# EAGLE design fpanel 10x2 v2 (EAGLE 8.6.0)
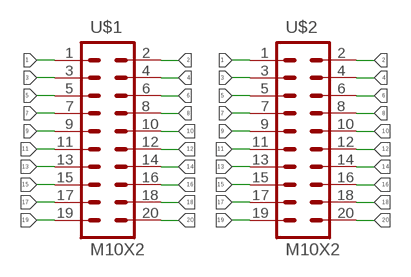
[diagram p0: schematic, sheet 1]

## Parts
U$1  M10X2  [2X10]
U$2  M10X2  [2X10]

## Nets
1: U$1.1 U$2.1
2: U$1.2 U$2.2
3: U$1.3 U$2.3
4: U$1.4 U$2.4
5: U$1.5 U$2.5
6: U$1.6 U$2.6
7: U$1.7 U$2.7
8: U$1.8 U$2.8
9: U$1.9 U$2.9
10: U$1.10 U$2.10
11: U$1.11 U$2.11
12: U$1.12 U$2.12
13: U$1.13 U$2.13
14: U$1.14 U$2.14
15: U$1.15 U$2.15
16: U$1.16 U$2.16
17: U$1.17 U$2.17
18: U$1.18 U$2.18
19: U$1.19 U$2.19
20: U$1.20 U$2.20

## Library data of the parts
U$1 U$2 = SparkFun-Connectors:M10X2: This was SPECIALLY designed to be used with our Graphic LCD Backpack. Be sure you want to use this! It is not only staggered on each line of header holes, but IT IS ALSO offset of the center point of the top and bottom lines by 5 mil. This causes the headers to lock into place on the "standard" footprint on the LCD screen. The extra squares on the tdocu layer are there simply to reference other pins (if you were to actually populate a longer header than ten long - this is what we do with the backpacks).

## Board
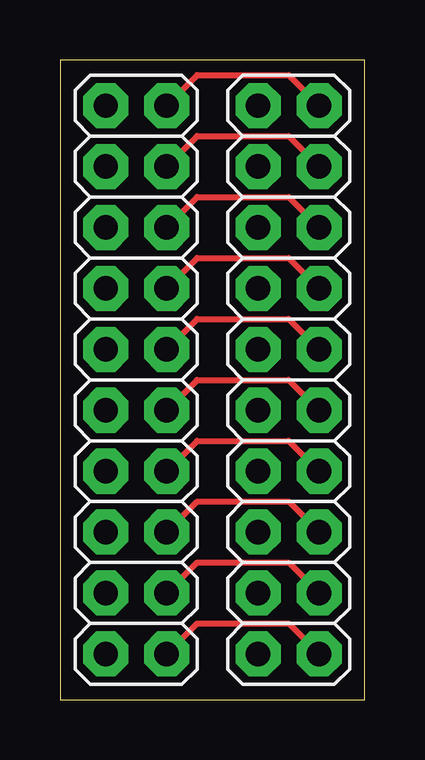
[diagram p1: board, top side]
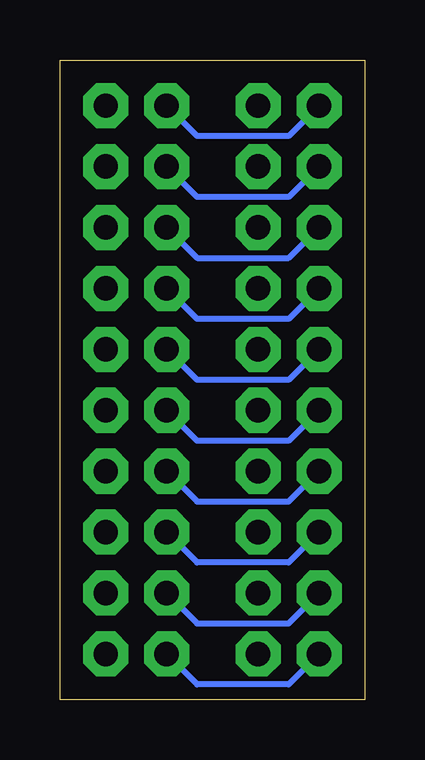
[diagram p2: board, bottom side, seen from below]

Size 12.7 x 26.67 mm. Coordinates in mm from the lower left corner, seen from the top.
Outline: 0,0 12.7,0 12.7,26.67 0,26.67 0,0
Copper layers (1*16): Top 0.0356mm / dielectric 1.5011mm / Bottom 0.0356mm
Design rules "LaenPCBOrder": minimum track width 6mil, minimum drill 13mil, track to track 6mil, track to pad 6mil, pad to pad 6mil, via to via 6mil, smd to smd 6mil, copper to edge 15mil, drill to drill 6mil, minimum pad ring 7mil, minimum via ring 7mil, stop-mask expansion 3mil, vias tented up to drill 0mil, thermal gap 10mil

### Footprints (pad centres in the part's own frame; a part is rotated, then mirrored left to right if it is on the bottom)
2X10 = drill 1.016 pad 1.88 octagon: 1 -11.43,-1.27; 2 -11.43,1.27; 3 -8.89,-1.27; 4 -8.89,1.27; 5 -6.35,-1.27; 6 -6.35,1.27; 7 -3.81,-1.27; 8 -3.81,1.27; 9 -1.27,-1.27; 10 -1.27,1.27; 11 1.27,-1.27; 12 1.27,1.27; 13 3.81,-1.27; 14 3.81,1.27; 15 6.35,-1.27; 16 6.35,1.27; 17 8.89,-1.27; 18 8.89,1.27; 19 11.43,-1.27; 20 11.43,1.27

### Placement (x,y rotation side)
U$1  9.53,13.34 90 top
U$2  3.17,13.34 90 top

### Tracks (layer width: path | path; a pad name or v marks a point on that pad's centre or on a via)
1
  Top 0.254: U$2.1 5.71,3.17 9.53,3.17 U$1.1
2
  Bottom 0.254: U$2.2 3.17,0.64 6.99,0.64 U$1.2
3
  Top 0.254: U$2.3 5.71,5.71 9.53,5.71 U$1.3
4
  Bottom 0.254: U$1.4 6.99,3.17 3.17,3.17 U$2.4
5
  Top 0.254: U$2.5 5.71,8.26 9.53,8.26 U$1.5
6
  Bottom 0.254: U$2.6 3.17,5.71 6.99,5.71 U$1.6
7
  Top 0.254: U$2.7 5.71,10.79 9.53,10.79 U$1.7
8
  Bottom 0.254: U$1.8 6.99,8.26 3.17,8.26 U$2.8
9
  Top 0.254: U$2.9 5.71,13.34 9.53,13.34 U$1.9
10
  Bottom 0.254: U$2.10 3.17,10.79 6.99,10.79 U$1.10
11
  Top 0.254: U$2.11 5.71,15.88 9.53,15.88 U$1.11
12
  Bottom 0.254: U$2.12 3.17,13.34 6.99,13.34 U$1.12
13
  Top 0.254: U$2.13 5.71,18.41 9.53,18.41 U$1.13
14
  Bottom 0.254: U$2.14 3.17,15.88 6.99,15.88 U$1.14
15
  Top 0.254: U$2.15 5.71,20.95 9.53,20.95 U$1.15
16
  Bottom 0.254: U$1.16 6.99,18.41 3.17,18.41 U$2.16
17
  Top 0.254: U$2.17 5.71,23.49 9.53,23.49 U$1.17
18
  Bottom 0.254: U$2.18 3.17,20.95 6.99,20.95 U$1.18
19
  Top 0.254: U$2.19 5.71,26.04 9.53,26.04 U$1.19
20
  Bottom 0.254: U$2.20 3.17,23.49 6.99,23.49 U$1.20